# Altium project line_follower.PrjPCB
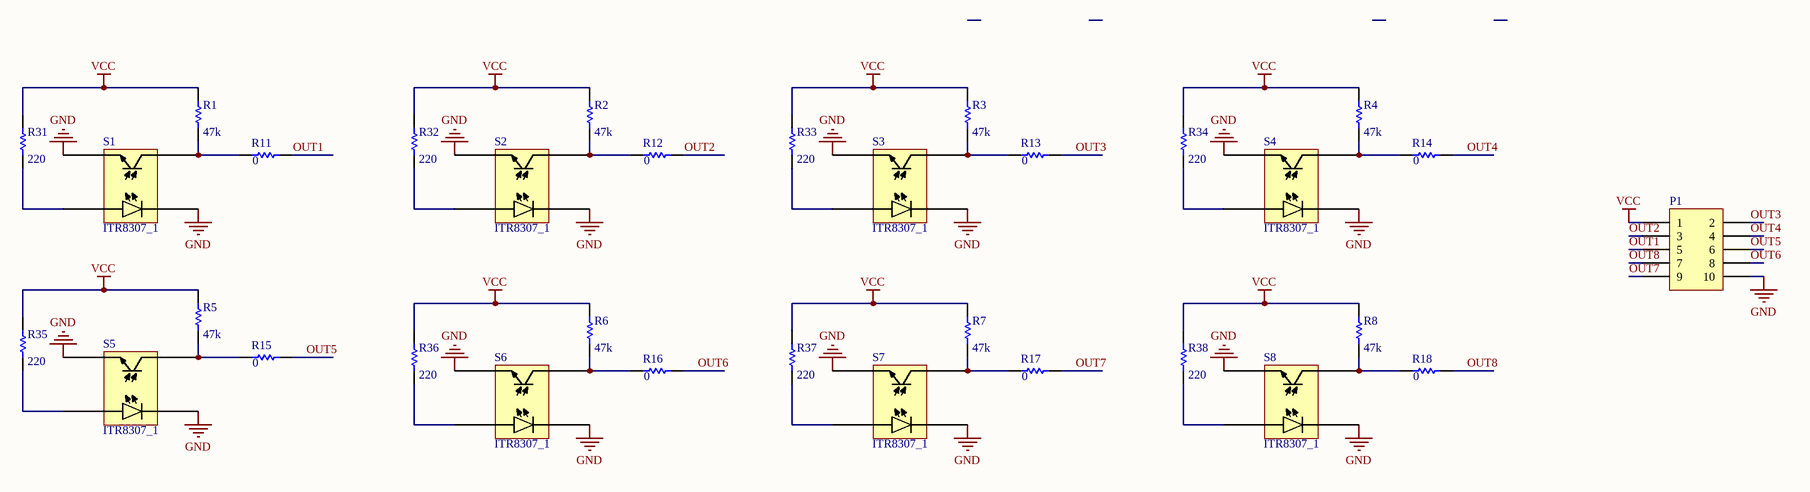
[diagram p0: sensors.SchDoc]
2 sheets, 50 parts. Net scope: global (net labels, ports and power ports of the same name join across sheets).
Board files: main_board.PcbDoc, sensors_7.PcbDoc, sensors_8.PcbDoc
Sheets:
  sensors.SchDoc
  main_board.SchDoc

## Sheet sensors.SchDoc
size A3

### Parts
(Parts that share a designator on the sheet are numbered #1, #2 ... from top to bottom, then left to right.)
P1  Header 5X2  [HDR-5x2 CON 2]  (value not drawn)
R1#1  value 47k  [C1206]  (hidden comment: Res1)
R2#1  value 47k  [C1206]  (hidden comment: Res1)
R3#1  value 47k  [C1206]  (hidden comment: Res1)
R4  value 47k  [C1206]  (hidden comment: Res1)
R5  value 47k  [C1206]  (hidden comment: Res1)
R6  value 47k  [C1206]  (hidden comment: Res1)
R7  value 47k  [C1206]  (hidden comment: Res1)
R8  value 47k  [C1206]  (hidden comment: Res1)
R11  value 0  [C1206]  (hidden comment: Res1)
R12  value 0  [C1206]  (hidden comment: Res1)
R13  value 0  [C1206]  (hidden comment: Res1)
R14  value 0  [C1206]  (hidden comment: Res1)
R15  value 0  [C1206]  (hidden comment: Res1)
R16  value 0  [C1206]  (hidden comment: Res1)
R17  value 0  [C1206]  (hidden comment: Res1)
R18  value 0  [C1206]  (hidden comment: Res1)
R31  value 220  [C1206]  (hidden comment: Res1)
R32  value 220  [C1206]  (hidden comment: Res1)
R33  value 220  [C1206]  (hidden comment: Res1)
R34  value 220  [C1206]  (hidden comment: Res1)
R35  value 220  [C1206]  (hidden comment: Res1)
R36  value 220  [C1206]  (hidden comment: Res1)
R37  value 220  [C1206]  (hidden comment: Res1)
R38  value 220  [C1206]  (hidden comment: Res1)
S1  ITR8307_1  [ITR8307 - TH]
S2  ITR8307_1  [ITR8307 - TH]
S3  ITR8307_1  [ITR8307 - TH]
S4  ITR8307_1  [ITR8307 - TH]
S5  ITR8307_1  [ITR8307 - TH]
S6  ITR8307_1  [ITR8307 - TH]
S7  ITR8307_1  [ITR8307 - TH]
S8  ITR8307_1  [ITR8307 - TH]

### Nets
GND: P1.10 S1.1 S1.3 S2.1 S2.3 S3.1 S3.3 S4.1 S4.3 S5.1 S5.3 S6.1 S6.3 S7.1 S7.3 S8.1 S8.3
VCC: P1.1 R1#1.2 R2#1.2 R3#1.2 R4.2 R5.2 R6.2 R7.2 R8.2 R31.2 R32.2 R33.2 R34.2 R35.2 R36.2 R37.2 R38.2
OUT1: P1.5 R11.1
OUT2: P1.3 R12.1
OUT3: P1.2 R13.1
OUT4: P1.4 R14.1
OUT5: P1.6 R15.1
OUT6: P1.8 R16.1
OUT7: P1.9 R17.1
OUT8: P1.7 R18.1
NetR1#1_1: R1#1.1 R11.2 S1.4
NetR2#1_1: R2#1.1 R12.2 S2.4
NetR3#1_1: R3#1.1 R13.2 S3.4
NetR4_1: R4.1 R14.2 S4.4
NetR5_1: R5.1 R15.2 S5.4
NetR6_1: R6.1 R16.2 S6.4
NetR7_1: R7.1 R17.2 S7.4
NetR8_1: R8.1 R18.2 S8.4
NetR31_1: R31.1 S1.2
NetR32_1: R32.1 S2.2
NetR33_1: R33.1 S3.2
NetR34_1: R34.1 S4.2
NetR35_1: R35.1 S5.2
NetR36_1: R36.1 S6.2
NetR37_1: R37.1 S7.2
NetR38_1: R38.1 S8.2

### Library data of the parts
P1 = Header 5X2: Header, 5-Pin, Dual row; LatestRevisionDate: 17-Jul-2002; LatestRevisionNote: Re-released for DXP Platform.; Publisher: Altium Limited
R1#1 R2#1 R3#1 R4-R8 R11-R18 R31-R38 = Res1: Resistor; Published: 8-Jun-2000; LatestRevisionDate: 17-Jul-2002; LatestRevisionNote: Re-released for DXP Platform.; PackageReference: AXIAL-0.3; Publisher: Altium Limited; PackageDescription: Axial Device, Thru-Hole; 2 Leads; 0.3 in Pin Spacing

## Sheet main_board.SchDoc
size A
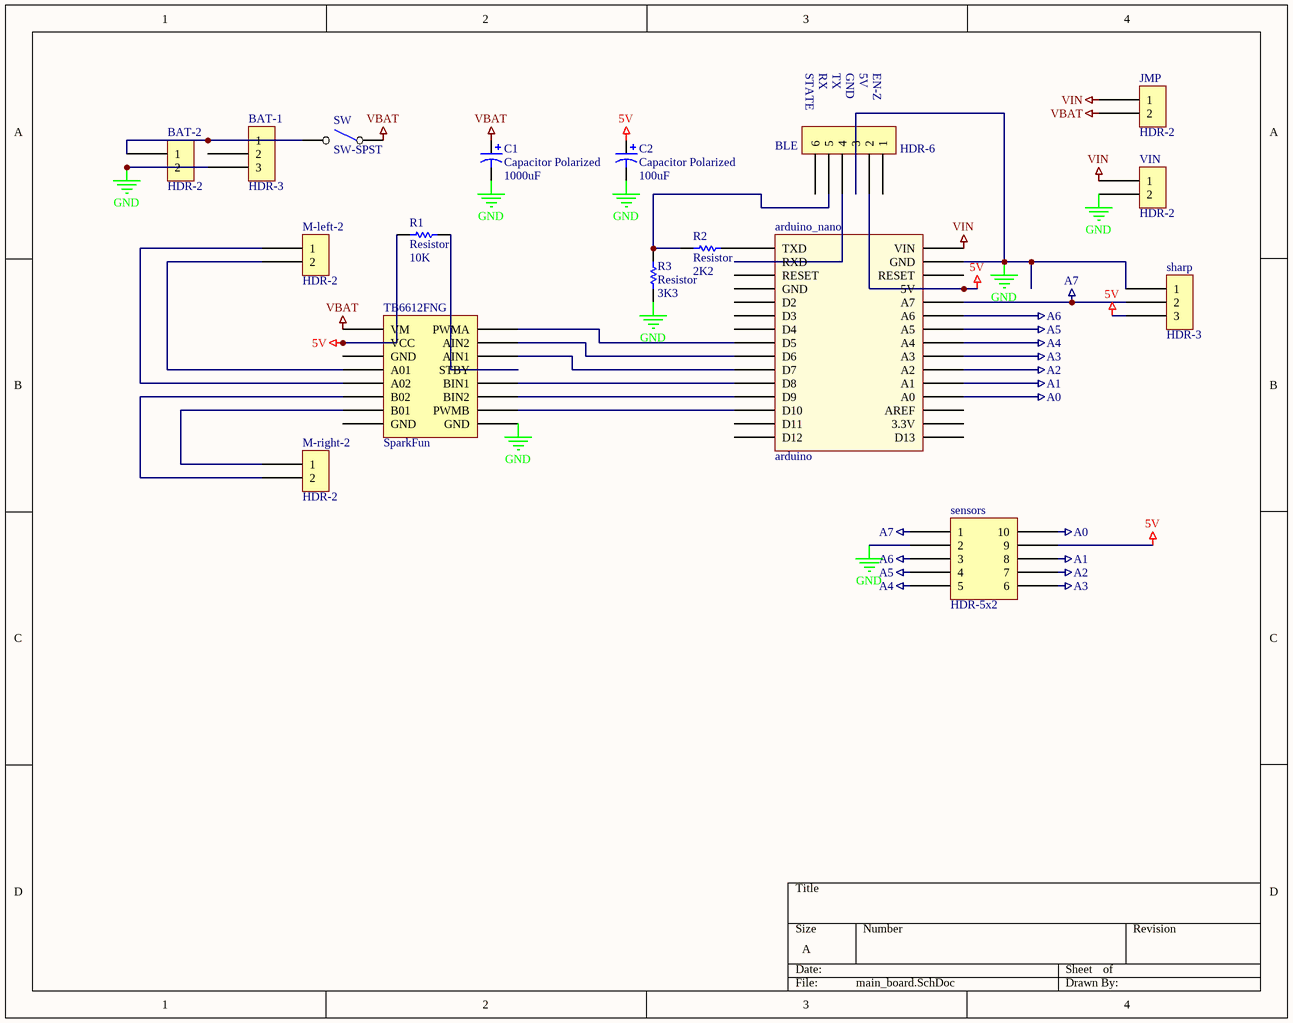
[diagram p1: main_board.SchDoc]

### Parts
(Parts that share a designator on the sheet are numbered #1, #2 ... from top to bottom, then left to right.)
arduino_nano  arduino  [Arduino_nano]
BAT-1  HDR-3  [HDR-3]
BAT-2  HDR-2  [HDR-2]
BLE  HDR-6  [HDR-6]
C1  Capacitor Polarized  value 1000uF  [ELCO-2]
C2  Capacitor Polarized  value 100uF  [ELCO-1]
JMP  HDR-2  [HDR-2]
M-left-2  HDR-2  [KLEMA2_SMALL]
M-right-2  HDR-2  [KLEMA2_SMALL]
R1#2  Resistor  value 10K  [AXIAL-4]
R2#2  Resistor  value 2K2  [AXIAL-4]
R3#2  Resistor  value 3K3  [AXIAL-4]
sensors  HDR-5x2  [HDR-5x2 CON]
sharp  HDR-3  [HDR-3]
SW  SW-SPST  [SW-3]
TB6612FNG  SparkFun  [TB6612FNG_SparkFun]
VIN  HDR-2  [HDR-2]

### Nets
5V: arduino_nano.27(5V) BLE.2 C2.1 R1#2.2 sensors.9 sharp.3 TB6612FNG.2(VCC)
A0: arduino_nano.19(A0) sensors.10
A1: arduino_nano.20(A1) sensors.8
A2: arduino_nano.21(A2) sensors.7
A3: arduino_nano.22(A3) sensors.6
A4: arduino_nano.23(A4) sensors.5
A5: arduino_nano.24(A5) sensors.4
A6: arduino_nano.25(A6) sensors.3
A7: arduino_nano.26(A7) sensors.1 sharp.2
GND: arduino_nano.29(GND) BAT-1.3 BAT-2.2 BLE.3 C1.2 C2.2 R3#2.2 sensors.2 sharp.1 TB6612FNG.9(GND) VIN.2
VBAT: C1.1 JMP.2 SW.1 TB6612FNG.1(VM)
VIN: arduino_nano.30(VIN) JMP.1 VIN.1
Netarduino_nano_1: arduino_nano.1(TXD) R2#2.1
Netarduino_nano_2: arduino_nano.2(RXD) BLE.4
Netarduino_nano_8: arduino_nano.8(D5) TB6612FNG.16(PWMA)
Netarduino_nano_9: arduino_nano.9(D6) TB6612FNG.15(AIN2)
Netarduino_nano_10: arduino_nano.10(D7) TB6612FNG.14(AIN1)
Netarduino_nano_11: arduino_nano.11(D8) TB6612FNG.12(BIN1)
Netarduino_nano_12: arduino_nano.12(D9) TB6612FNG.11(BIN2)
Netarduino_nano_13: arduino_nano.13(D10) TB6612FNG.10(PWMB)
NetBAT-1_1: BAT-1.1 BAT-2.1 SW.2
NetBLE_5: BLE.5 R2#2.2 R3#2.1
NetM-left-2_1: M-left-2.1 TB6612FNG.5(A02)
NetM-left-2_2: M-left-2.2 TB6612FNG.4(A01)
NetM-right-2_1: M-right-2.1 TB6612FNG.7(B01)
NetM-right-2_2: M-right-2.2 TB6612FNG.6(B02)
NetR1#2_1: R1#2.1 TB6612FNG.13(STBY)

Not connected (* = marked no-connect by the designer): arduino_nano 3(RESET) 4(GND) 5(D2) 6(D3) 7(D4) 14(D11) 15(D12) 16(D13) 17(3.3V) 18(AREF) 28(RESET); BAT-1 2; BLE 1 6; TB6612FNG 3(GND) 8(GND)

### Notes on the sheet
- (near BLE) STATE
- RX
- TX
- GND
- 5V
- EN-Z

### Library data of the parts
arduino_nano = Arduino_Nano
TB6612FNG = TB6612FNG_SparkFun
C1 C2 = Capacitor Polarized: Published: 8-Jun-2000; LatestRevisionDate: 17-Jul-2002; LatestRevisionNote: Re-released for DXP Platform.; PackageReference: POLAR0.8; Publisher: Altium Limited
R1#2 R2#2 R3#2 = Resistor: Published: 8-Jun-2000; LatestRevisionDate: 17-Jul-2002; LatestRevisionNote: Re-released for DXP Platform.; PackageReference: AXIAL-0.3; Publisher: Altium Limited

## Nets that join several sheets
GND: sensors (17 pins), main_board (11 pins)